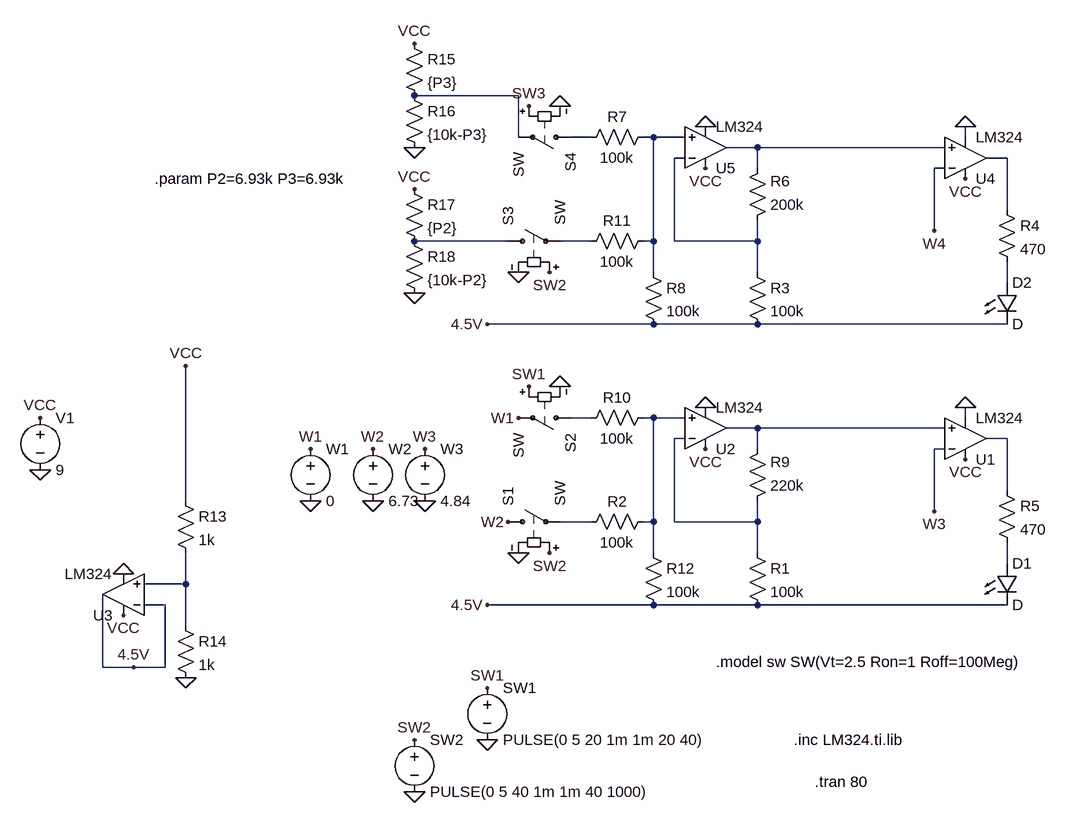
[diagram p0: schematic Draft1 (perceptron).asc]
Draft1 (perceptron).asc, the LTspice schematic file:
Version 4.1
SHEET 1 1224 688
WIRE -64 -512 -224 -512
WIRE -64 -448 -64 -512
WIRE 48 -448 16 -448
WIRE 144 -448 128 -448
WIRE 192 -448 144 -448
WIRE 624 -448 624 -464
WIRE 304 -432 256 -432
WIRE 592 -432 304 -432
WIRE 192 -416 176 -416
WIRE 688 -416 656 -416
WIRE 304 -400 304 -432
WIRE 592 -400 576 -400
WIRE 688 -336 688 -416
WIRE 576 -304 576 -400
WIRE -80 -288 -224 -288
WIRE 48 -288 0 -288
WIRE 144 -288 144 -448
WIRE 144 -288 128 -288
WIRE 176 -288 176 -416
WIRE 304 -288 304 -320
WIRE 304 -288 176 -288
WIRE 144 -240 144 -288
WIRE 304 -240 304 -288
WIRE 688 -224 688 -256
WIRE 144 -160 -112 -160
WIRE 304 -160 144 -160
WIRE 688 -160 304 -160
WIRE 48 -16 16 -16
WIRE 144 -16 128 -16
WIRE 192 -16 144 -16
WIRE 624 -16 624 -32
WIRE 304 0 256 0
WIRE 592 0 304 0
WIRE 192 16 176 16
WIRE 688 16 656 16
WIRE 304 32 304 0
WIRE 592 32 576 32
WIRE 688 96 688 16
WIRE -576 112 -576 -96
WIRE 576 128 576 32
WIRE 48 144 0 144
WIRE 144 144 144 -16
WIRE 144 144 128 144
WIRE 176 144 176 16
WIRE 304 144 304 112
WIRE 304 144 176 144
WIRE 144 192 144 144
WIRE 304 192 304 144
WIRE 688 208 688 176
WIRE -576 240 -576 192
WIRE -576 240 -640 240
WIRE -608 272 -640 272
WIRE 144 272 -112 272
WIRE 304 272 144 272
WIRE 688 272 304 272
WIRE -576 304 -576 240
WIRE -704 368 -704 256
WIRE -656 368 -704 368
WIRE -608 368 -608 272
WIRE -608 368 -656 368
FLAG -800 64 0
FLAG -800 -16 VCC
FLAG -672 288 VCC
FLAG -672 224 0
FLAG -656 368 4.5V
FLAG -576 384 0
FLAG -112 272 4.5V
FLAG 224 -32 0
FLAG 224 32 VCC
FLAG 624 48 VCC
FLAG 624 -32 0
FLAG -384 112 0
FLAG -288 112 0
FLAG -208 112 0
FLAG -384 32 W1
FLAG -288 32 W2
FLAG -208 32 W3
FLAG -576 -96 VCC
FLAG -80 144 W2
FLAG -64 -16 W1
FLAG 576 128 W3
FLAG -64 192 0
FLAG 0 -64 0
FLAG -224 560 0
FLAG -112 480 0
FLAG -224 480 SW2
FLAG -16 192 SW2
FLAG -112 400 SW1
FLAG -48 -64 SW1
FLAG -112 -160 4.5V
FLAG 224 -464 0
FLAG 224 -400 VCC
FLAG 624 -384 VCC
FLAG 624 -464 0
FLAG 576 -304 W4
FLAG -64 -240 0
FLAG 0 -496 0
FLAG -16 -240 SW2
FLAG -48 -496 SW3
FLAG -224 -368 VCC
FLAG -224 -592 VCC
FLAG -224 -208 0
FLAG -224 -432 0
SYMBOL res 288 176 R0
SYMATTR InstName R1
SYMATTR Value 100k
SYMBOL res 672 80 R0
SYMATTR InstName R5
SYMATTR Value 470
SYMBOL res 288 128 M180
WINDOW 0 36 76 Left 2
WINDOW 3 36 40 Left 2
SYMATTR InstName R9
SYMATTR Value 220k
SYMBOL res 32 0 R270
WINDOW 0 32 56 VTop 2
WINDOW 3 0 56 VBottom 2
SYMATTR InstName R10
SYMATTR Value 100k
SYMBOL res 128 176 R0
SYMATTR InstName R12
SYMATTR Value 100k
SYMBOL res -592 96 R0
SYMATTR InstName R13
SYMATTR Value 1k
SYMBOL res -592 288 R0
SYMATTR InstName R14
SYMATTR Value 1k
SYMBOL LED 672 208 R0
SYMATTR InstName D1
SYMBOL voltage -800 -32 R0
WINDOW 123 0 0 Left 0
WINDOW 39 0 0 Left 0
SYMATTR InstName V1
SYMATTR Value 9
SYMBOL voltage -384 16 R0
WINDOW 123 0 0 Left 0
WINDOW 39 0 0 Left 0
SYMATTR InstName W1
SYMATTR Value 0
SYMBOL voltage -288 16 R0
WINDOW 123 0 0 Left 0
WINDOW 39 0 0 Left 0
SYMATTR InstName W2
SYMATTR Value 6.73
SYMBOL voltage -208 16 R0
WINDOW 123 0 0 Left 0
WINDOW 39 0 0 Left 0
SYMATTR InstName W3
SYMATTR Value 4.84
SYMBOL res 144 128 R90
WINDOW 0 0 56 VBottom 2
WINDOW 3 32 56 VTop 2
SYMATTR InstName R2
SYMATTR Value 100k
SYMBOL sw -96 144 R270
SYMATTR InstName S1
SYMBOL sw 32 -16 R90
SYMATTR InstName S2
SYMBOL voltage -224 464 R0
WINDOW 123 0 0 Left 0
WINDOW 39 0 0 Left 0
SYMATTR InstName SW2
SYMATTR Value PULSE(0 5 40 1m 1m 40 1000)
SYMBOL voltage -112 384 R0
WINDOW 123 0 0 Left 0
WINDOW 39 0 0 Left 0
SYMATTR InstName SW1
SYMATTR Value PULSE(0 5 20 1m 1m 20 40)
SYMBOL OpAmps\\opamp2 624 80 M180
SYMATTR InstName U1
SYMATTR Value LM324
SYMBOL OpAmps\\opamp2 224 64 M180
SYMATTR InstName U2
SYMATTR Value LM324
SYMBOL OpAmps\\opamp2 -672 320 R180
SYMATTR InstName U3
SYMATTR Value LM324
SYMBOL res 288 -256 R0
SYMATTR InstName R3
SYMATTR Value 100k
SYMBOL res 672 -352 R0
SYMATTR InstName R4
SYMATTR Value 470
SYMBOL res 288 -304 M180
WINDOW 0 36 76 Left 2
WINDOW 3 36 40 Left 2
SYMATTR InstName R6
SYMATTR Value 200k
SYMBOL res 32 -432 R270
WINDOW 0 32 56 VTop 2
WINDOW 3 0 56 VBottom 2
SYMATTR InstName R7
SYMATTR Value 100k
SYMBOL res 128 -256 R0
SYMATTR InstName R8
SYMATTR Value 100k
SYMBOL LED 672 -224 R0
SYMATTR InstName D2
SYMBOL res 144 -304 R90
WINDOW 0 0 56 VBottom 2
WINDOW 3 32 56 VTop 2
SYMATTR InstName R11
SYMATTR Value 100k
SYMBOL sw -96 -288 R270
SYMATTR InstName S3
SYMBOL sw 32 -448 R90
SYMATTR InstName S4
SYMBOL OpAmps\\opamp2 624 -352 M180
SYMATTR InstName U4
SYMATTR Value LM324
SYMBOL OpAmps\\opamp2 224 -368 M180
SYMATTR InstName U5
SYMATTR Value LM324
SYMBOL res -240 -608 R0
SYMATTR InstName R15
SYMATTR Value {P3}
SYMBOL res -240 -528 R0
SYMATTR InstName R16
SYMATTR Value {10k-P3}
SYMBOL res -240 -384 R0
SYMATTR InstName R17
SYMATTR Value {P2}
SYMBOL res -240 -304 R0
SYMATTR InstName R18
SYMATTR Value {10k-P2}
TEXT 392 544 Left 2 !.tran 80
TEXT 240 360 Left 2 !.model sw SW(Vt=2.5 Ron=1 Roff=100Meg)
TEXT 360 480 Left 2 !.inc LM324.ti.lib
TEXT -624 -384 Left 2 !.param P2=6.93k P3=6.93k

The netlist it stands for:
* Draft1 (perceptron).asc
R1 N013 4.5V 100k
R5 N014 N016 470
R9 N013 N012 220k
R10 N010 N011 100k
R12 N011 4.5V 100k
R13 VCC N017 1k
R14 N017 0 1k
D1 N016 4.5V D
V1 VCC 0 9
V§W1 W1 0 0
V§W2 W2 0 6.73
V§W3 W3 0 4.84
R2 N011 N015 100k
S1 W2 N015 SW2 0 SW
S2 N010 W1 SW1 0 SW
V§SW2 SW2 0 PULSE(0 5 40 1m 1m 40 1000)
V§SW1 SW1 0 PULSE(0 5 20 1m 1m 20 40)
X§U1 N012 W3 VCC 0 N014 LM324  ; pins In+ In- V+ V- OUT
X§U2 N011 N013 VCC 0 N012 LM324  ; pins In+ In- V+ V- OUT
X§U3 N017 4.5V VCC 0 4.5V LM324  ; pins In+ In- V+ V- OUT
R3 N005 4.5V 100k
R4 N006 N009 470
R6 N005 N004 200k
R7 N002 N003 100k
R8 N003 4.5V 100k
D2 N009 4.5V D
R11 N003 N008 100k
S3 N007 N008 SW2 0 SW
S4 N002 N001 SW3 0 SW
X§U4 N004 W4 VCC 0 N006 LM324  ; pins In+ In- V+ V- OUT
X§U5 N003 N005 VCC 0 N004 LM324  ; pins In+ In- V+ V- OUT
R15 VCC N001 {P3}
R16 N001 0 {10k-P3}
R17 VCC N007 {P2}
R18 N007 0 {10k-P2}
.model D D
.lib standard.dio
.tran 80
.model sw SW(Vt=2.5 Ron=1 Roff=100Meg)
.inc LM324.ti.lib
.param P2=6.93k P3=6.93k
.backanno
.end

* Results of the author's LTspice run, read from the files saved beside the schematic
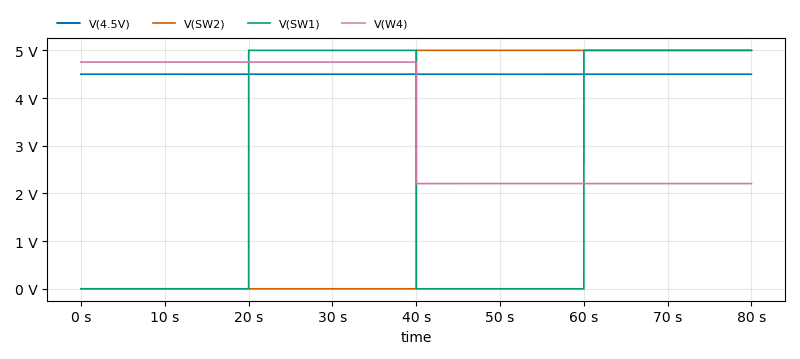
[diagram p1: Transient Analysis of Draft1 (perceptron).asc, plotted from the saved traces]
* Transient Analysis, 1 run:
*   V(4.5V): min 4.492 V, max 4.508 V, average 4.5 V, rms 4.5 V, last 4.5 V
*   V(SW2): min 0 V, max 5 V, average 2.5 V, rms 3.536 V, last 5 V
*   V(SW1): min 0 V, max 5 V, average 2.5 V, rms 3.536 V, last 5 V
*   V(W4): min 2.203 V, max 4.755 V, average 3.481 V, rms 3.707 V, last 2.206 V